# Altium schematic sheet Communication.SchDoc
size A3; SheetNumber: 2; SheetTotal: 6
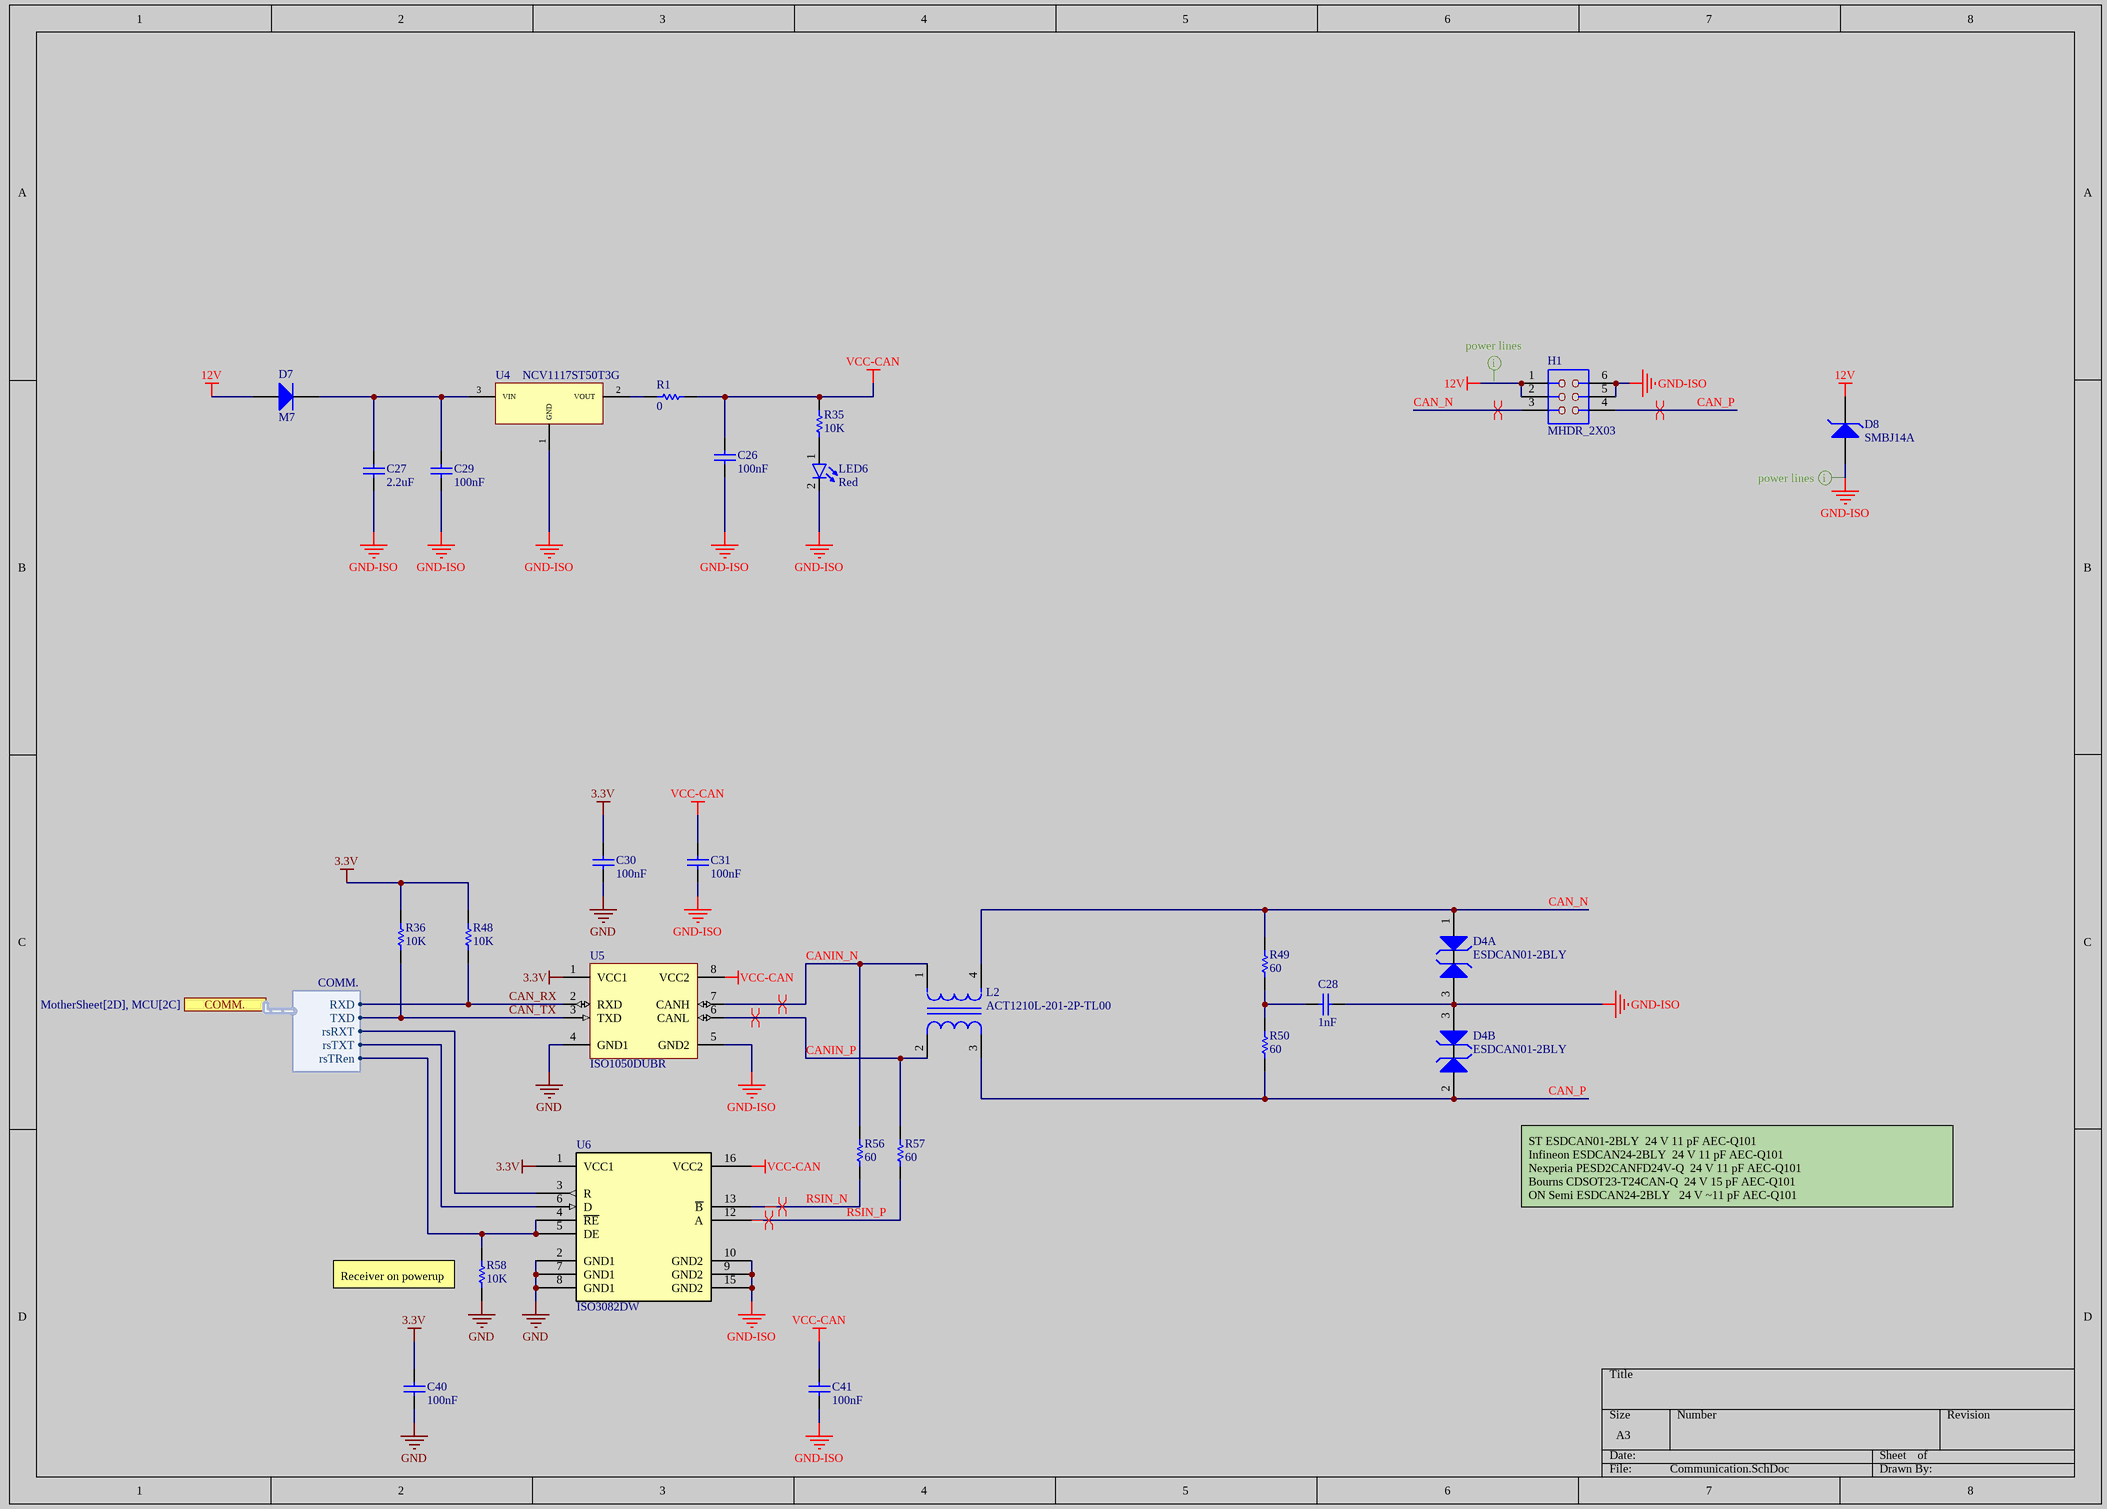
[diagram p0: Communication.SchDoc]

## Parts
C26  100nF  [CAPC0603]
C27  2.2uF  [cap1206]
C28  1nF  [CAP0603]
C29  100nF  [CAPC0603]
C30  100nF  [CAPC0603]
C31  100nF  [CAPC0603]
C40  100nF  [CAPC0603]
C41  100nF  [CAPC0603]
D4  ESDCAN01-2BLY  [NPN]  (parts A,B of 2)
D7  M7  [SS36]
D8  SMBJ14A  [SMBJSeries_LTF-M]
H1  MHDR_2X03  [miniATX 2 × 3]
L2  ACT1210L-201-2P-TL00  [FP-ACT1210L-MFG]
LED6  Red  [led]
R1  0  [RES0603]
R35  10K  [RES0603]
R36  10K  [RES0603]
R48  10K  [RES0603]
R49  60  [RES0603]
R50  60  [RES0603]
R56  60  [RES0603]
R57  60  [RES0603]
R58  10K  [RES0603]
U4  NCV1117ST50T3G  [AMS1117]
U5  ISO1050DUBR  [soic 8]
U6  ISO3082DW  [DW16]

## Ports
COMM. (harness COMM., see MotherSheet[2D], MCU[2C])

## Harnesses
COMM.: RXD, TXD, rsRXT, rsTXT, rsTRen

## Nets
3.3V: C30.2 C40.2 R36.1 R48.1 U5.1(VCC1) U6.1(VCC1)
12V: D7.1(A) D8.1(A) H1.1 H1.2
GND: C30.1 C40.1 R58.2 U5.4(GND1) U6.2(GND1) U6.7(GND1) U6.8(GND1)
GND-ISO: C26.1 C27.1 C28.1 C29.1 C31.1 C41.1 D4.3(A) D8.2(B) H1.5 H1.6 LED6.2(K) U4.1(GND) U5.5(GND2) U6.9(GND2) U6.10(GND2) U6.15(GND2)
VCC-CAN: C26.2 C31.2 C41.2 R1.2 R35.1 U5.8(VCC2) U6.16(VCC2)
CAN_N: D4.1(A) H1.3 L2.4 R49.1
CAN_P: D4.2(A) H1.4 L2.3 R50.1
CAN_RX: R48.2 U5.2(RXD) ; port COMM..RXD
CAN_TX: R36.2 U5.3(TXD) ; port COMM..TXD
CANIN_N: L2.1 R56.2 U5.7(CANH)
CANIN_P: L2.2 R57.1 U5.6(CANL)
RSIN_N: R56.1 U6.13(~{B})
RSIN_P: R57.2 U6.12(A)
NetC27_2: C27.2 C29.2 D7.2(K) U4.3(VIN)
NetC28_2: C28.2 R49.2 R50.2
NetLED6_1: LED6.1(A) R35.2
NetR1_1: R1.1 U4.2(VOUT)
NetR58_1: R58.1 U6.4(~{RE}) U6.5(DE) ; port COMM..rsTRen
NetU6_3: U6.3(R) ; port COMM..rsRXT
NetU6_6: U6.6(D) ; port COMM..rsTXT

## Layout directives
differential pair: CAN_N, CAN_P, CANIN_N, CANIN_P, RSIN_N, RSIN_P
rule Width Constraint [Pref Width = 1mm    Min Width = 1mm    Max Width = 1mm]; rule Routing Via Style [Pref Size = 2mm    Pref Hole Size = 1mm]; rule Routing Via Style [Pref Size = 2mm    Pref Hole Size = 1mm]: 12V, GND-ISO

## Notes on the sheet
- ST ESDCAN01-2BLY		24 V	11 pF	AEC-Q101
  Infineon ESDCAN24-2BLY		24 V	11 pF	AEC-Q101
  Nexperia PESD2CANFD24V-Q		24 V	11 pF	AEC-Q101
  Bourns CDSOT23-T24CAN-Q		24 V	15 pF	AEC-Q101
  ON Semi ESDCAN24-2BLY 		24 V	~11 pF	AEC-Q101
- (near R58) Receiver on powerup

## Library data of the parts
C26-C31 C40 C41 = Capacitor: Published: 8-Jun-2000; Publisher: Altium Limited
  C26 C29-C31 C40 C41: LatestRevisionDate: 17-Jul-2002; LatestRevisionNote: Re-released for DXP Platform.; PackageReference: C0805; Value: 100nF
  C27: LatestRevisionDate: 17-Jul-2002; LatestRevisionNote: Re-released for DXP Platform.; PackageReference: C0805; Value: 2.2uF
  C28: LatestRevisionDate: 29-May-2009; LatestRevisionNote: IPC-7351 Footprint Added.; PackageReference: C1206; PackageDescription: Chip Capacitor; Value: 1nF
D4 = TVS: transiebt voltage suppressor
D7 = SS36
D8 = SMBJ14ALK: ESD protection diode / TVS diodes
H1 = HDR_mini_2 × 3: Male Header 2X03
L2 = line filter CMP-08256-000003-1: CMC 200UH 70MA 2LN SMD; Manufacturer: TDK; Test Frequency: 100kHz; Series Resistance: 5.5Ω; Impedance At Frequency: 9.5kΩ @ 10MHz; Tolerance: -10/30%; Automotive Grade: Grade 1; Automotive: Yes; ComponentLink2URL: https://product.tdk.com/info/en/catalog/datasheets/cmf_automotive_signal_act1210l-201_en.pdf; Height: 2.5mm; RoHS: TRUE; Rms Current: 70mA; Temperature Range High: +125°C; Composition: Wirewound; Device Class L1: Passive Components; Device Class L3: Common Mode Chokes; Value: 200uH; Category: Ind; Mouser Description: Ind Common Mode Choke 200uH 9.5KOhm 70mA 5.5Ohm -10% to 30% Wirewound 4-Pin 1210; Device Class L2: EMI / RFI Components; Temperature Range Low: -40°C; Package: ACT1210L; Digikey Description: CMC 200UH 70MA 2LN SMD; Octopart: https://octopart.com/act1210l-201-2p-tl00-tdk-81014617; Manufacturer Part Number: ACT1210L-201-2P-TL00; Lead Free: Yes; Inductance: 200uH; Temperature: -40°C to +125°C; ComponentLink2Description: Datasheet
LED6 = LED: Designer: Saeid Jorablo; Organazation: ControTec; Adding Date: 1387/12/22; Color: Red; Size: SMD 0603
R1 R35 R36 R48-R50 R56-R58 = Res: Resistor; Published: 8-Jun-2000; LatestRevisionDate: 17-Jul-2002; LatestRevisionNote: Re-released for DXP Platform.; PackageReference: AXIAL-0.3; Publisher: Altium Limited; PackageDescription: Axial Device, Thru-Hole; 2 Leads; 0.3 in Pin Spacing
  R1: Value: 0
  R35 R36 R48 R58: Value: 10K
  R49 R50 R56 R57: Value: 60
U4 = AMS1117: NCP1117ST50T3G LDO 5V
U5 = ISO1050DUBR: Isolated CAN Transceiver, -55 to 105 degC, 8-pin SOP (DUB), Green (RoHS & no Sb/Br); Manufacturer: Texas Instruments; Rating: Catalog; Isolated: Yes; Drivers Per Package: 1; PackageReference: DUB0008A; PartNumber: ISO1050DUBR; ComponentLink2Description: Package Specification; ComponentLink1Description: Datasheet; Mounting Technology: Surface Mount; ComponentLink1URL: http://www.ti.com/general/docs/lit/getliterature.tsp?genericPartNumber=ISO1050&fileType=pdf; ComponentLink2URL: http://www.ti.com/litv/pdf/mpds247b; Eco-Plan: Green (RoHS & no Sb/Br); PackageDescription: 8-Pin Small Outline Package 2.54 mm Pitch; PackageVersion: revC, May-2006; SubFamily: CAN; DatasheetVersion: SLLS983E
U6 = ISO3082DW: 200-Kbps, half-duplex, 2.5-kVrms isolated RS-485 & RS-422 transceiver 16-SOIC -40 to 85; Manufacturer_Name: Texas Instruments; Copyright: Copyright (C) 2025 Ultra Librarian. All rights reserved.; Manufacturer_Part_Number: ISO3082DW; RefDes: RefDes; Type: Type